# Altium schematic sheet ChargeControlBoard.SchDoc
size A3
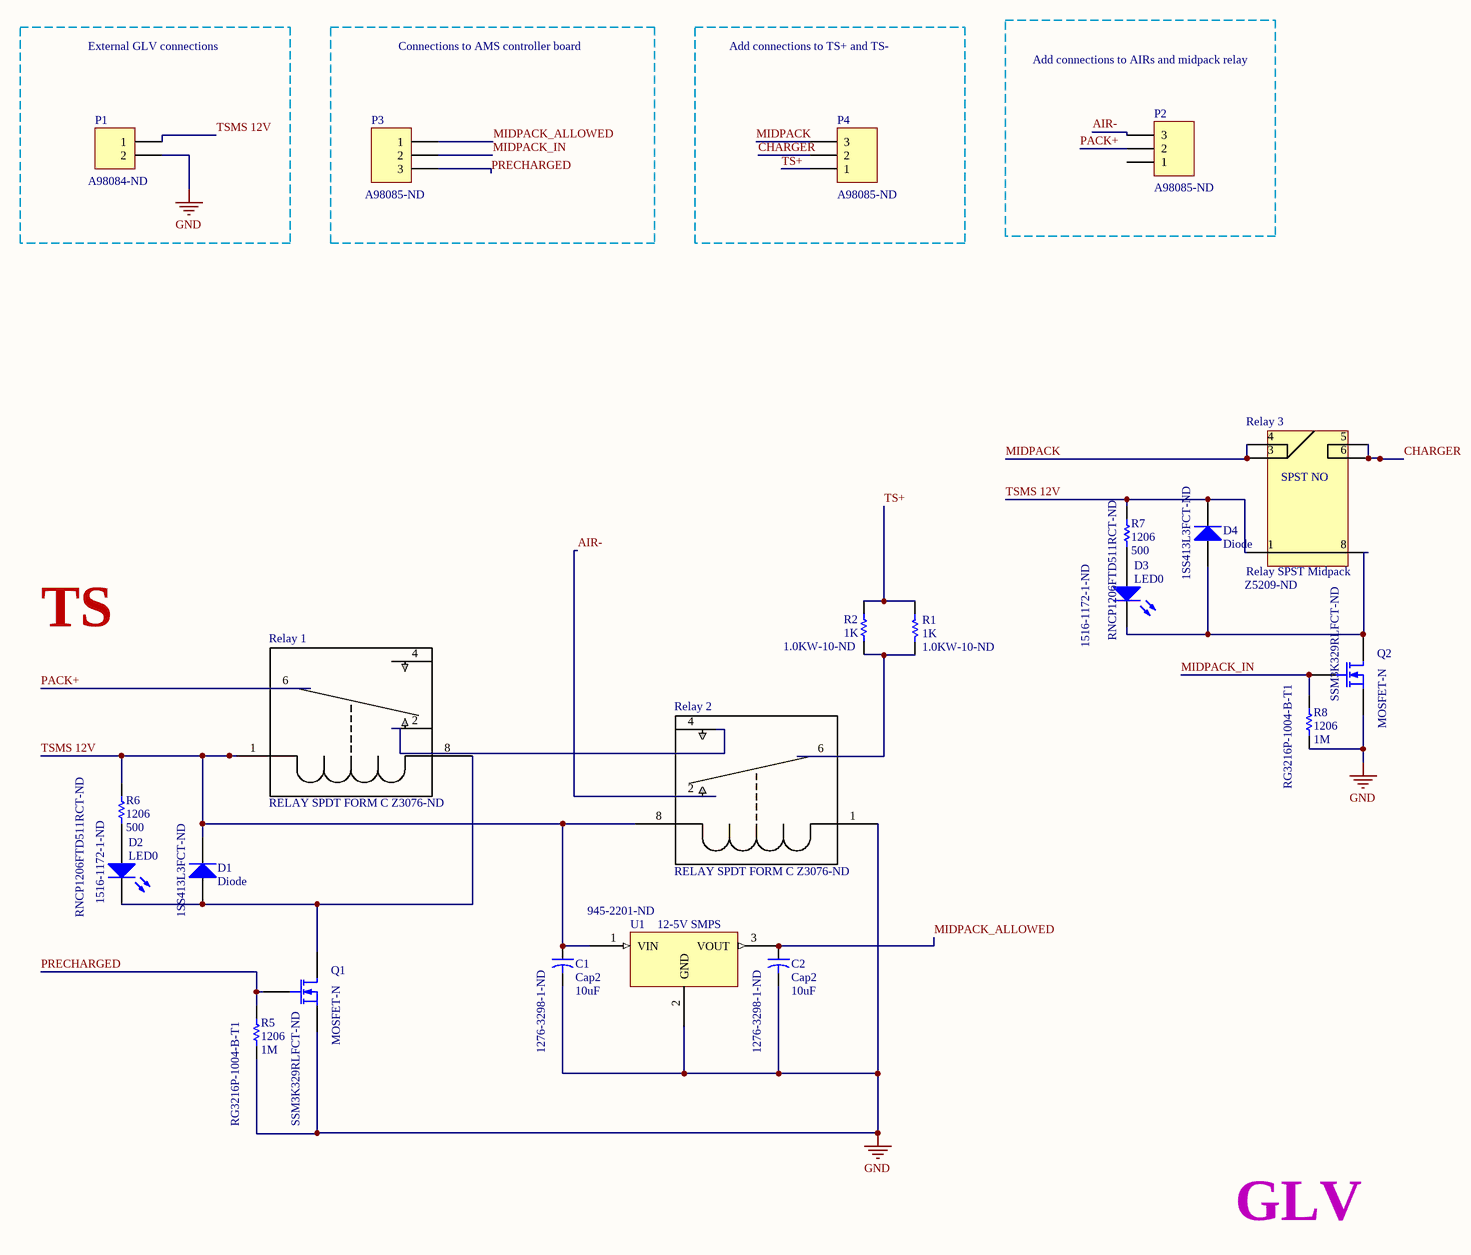
[diagram p0: ChargeControlBoard.SchDoc]

## Parts
C1  Cap2  value 10uF  Supplier Part Number 1: 1276-3298-1-ND  [1206]
C2  Cap2  value 10uF  Supplier Part Number 1: 1276-3298-1-ND  [1206]
D1  Diode  Supplier Part Number 1: 1SS413L3FCT-ND  [DIODE SODFL100X48-2N]
D2  LED0  Supplier Part Number 1: 1516-1172-1-ND  [C1206]
D3  LED0  Supplier Part Number 1: 1516-1172-1-ND  [C1206]
D4  Diode  Supplier Part Number 1: 1SS413L3FCT-ND  [DIODE SODFL100X48-2N]
P1  Supplier Part Number: A98084-ND  [2 Pos wire to board]  (hidden comment: Header 2)
P2  Supplier Part Number: A98085-ND  [3 Pos wire to board]  (hidden comment: Header 3)
P3  Supplier Part Number: A98085-ND  [3 Pos wire to board]  (hidden comment: Header 3)
P4  Supplier Part Number: A98085-ND  [3 Pos wire to board]  (hidden comment: Header 3)
Q1  MOSFET-N  Supplier Part Number 1: SSM3K329RLFCT-ND  [SOT23]
Q2  MOSFET-N  Supplier Part Number 1: SSM3K329RLFCT-ND  [SOT23]
R1  value 1K  Supplier Part Number: 1.0KW-10-ND  [Res 1k 10W]  (hidden comment: Res1)
R2  value 1K  Supplier Part Number: 1.0KW-10-ND  [Res 1k 10W]  (hidden comment: Res1)
R5  1206  value 1M  Supplier Part Number 1: RG3216P-1004-B-T1  [1206 (High Density)]
R6  1206  value 500  Supplier Part Number 1: RNCP1206FTD511RCT-ND  [C1206]
R7  1206  value 500  Supplier Part Number 1: RNCP1206FTD511RCT-ND  [C1206]
R8  1206  value 1M  Supplier Part Number 1: RG3216P-1004-B-T1  [1206 (High Density)]
Relay_1  RELAY SPDT FORM C Z3076-ND  [RELAY SPDT FORM C Z3076-ND]
Relay_2  RELAY SPDT FORM C Z3076-ND  [RELAY SPDT FORM C Z3076-ND]  (net tie, no BOM)
Relay_3  Relay SPST Midpack  Supplier Part Number 1: Z5209-ND  [Relay SPDT NO MIDPACK]
U1  12-5V SMPS  Supplier Part Number 1: 945-2201-ND  [Rr-788E5]

## Blocks framed on the sheet
External GLV connections: P1
Connections to AMS controller board: P3
Add connections to TS+ and TS-: P4
Add connections to AIRs and midpack relay: P2

## Nets
GND: C1.2 C2.2 P1.2 Q1.3(S) Q2.3(S) R5.1 R8.1 Relay_2.1 U1.2(GND)
AIR-: P2.3 Relay_2.2
CHARGER: P4.2 Relay_3.5 Relay_3.6
MIDPACK: P4.3 Relay_3.3 Relay_3.4
MIDPACK_ALLOWED: C2.1 P3.1 U1.3(VOUT)
MIDPACK_IN: P3.2 Q2.2(G) R8.2
PACK+: P2.2 Relay_1.6
PRECHARGED: P3.3 Q1.2(G) R5.2
TS+: P4.1 R1.2 R2.2
TSMS 12V: C1.1 D1.2(K) D4.2(K) P1.1 R6.1 R7.1 Relay_1.1 Relay_2.8 Relay_3.1 U1.1(VIN)
NetD1_1: D1.1(A) D2.2(K) Q1.1(D) Relay_1.8
NetD2_1: D2.1(A) R6.2
NetD3_1: D3.1(A) R7.2
NetD3_2: D3.2(K) D4.1(A) Q2.1(D) Relay_3.8
NetR1_1: R1.1 R2.1 Relay_2.6
NetRelay_1_2: Relay_1.2 Relay_2.4

Not connected (* = marked no-connect by the designer): P2 1; Relay_1 4(3)

## Notes on the sheet
- TS
- GLV
- Document name:
- Date:
- Time:
- Project name:
- Drawn by:
- Validation
- Sheet
- University of Victoria
- 3800 Finnerty Road
- Victoria BC V8P 5C2
- of
- Revision:
- CANADA
- Size:
- A3
- (in symbol Relay SPST Midpack) SPST NO

## Library data of the parts
C1 C2 = Cap2: Capacitor; Published: 23-Sep-2002; PackageReference: CAPR5-4X5; Publisher: Altium Limited; PackageDescription: Capacitor; 2 Leads; Supplier 1: Digi-Key
D1 D4 = Diode: Switching diode; Published: 8-Jun-2000; LatestRevisionDate: 17-Jul-2002; LatestRevisionNote: Re-released for DXP Platform.; PackageVersion: Sep-1996; PackageReference: SMC; Publisher: Altium Limited; PackageDescription: DO-214-AB/SMC; 2 C-Bend Leads; Body 7.9 x 5.9 mm, inc. leads (LxW); Code_JEDEC: DO-214-AB; Supplier 1: Digi-Key
D2 D3 = LED0: Typical INFRARED GaAs LED; Published: 8-Jun-2000; LatestRevisionDate: 08-Jul-2005; LatestRevisionNote: Mech Layer 1 removed.; PackageReference: LED-0; Publisher: Altium Limited; PackageDescription: LED; 2 Leads; Supplier 1: Digi-Key
P1 = Header 2: Header, 2-Pin; LatestRevisionDate: 17-Jul-2002; LatestRevisionNote: Re-released for DXP Platform.; Publisher: Altium Limited
P2-P4 = Header 3: Header, 3-Pin; LatestRevisionDate: 17-Jul-2002; LatestRevisionNote: Re-released for DXP Platform.; Publisher: Altium Limited
Q1 Q2 = MOSFET-N: N-Channel MOSFET; Published: 8-Jun-2000; LatestRevisionDate: 17-Jul-2002; LatestRevisionNote: Re-released for DXP Platform.; PackageVersion: 1995/1996; PackageReference: E3; Publisher: Altium Limited; PackageDescription: TO, Flat Index; 3 In-Line, Axial Leads; Body Dia. 4.6mm; Lead Dia. 0.5 mm (max); Supplier 1: Digi-Key
R1 R2 R5-R8 = Res1: Resistor; Published: 8-Jun-2000; LatestRevisionDate: 17-Jul-2002; LatestRevisionNote: Re-released for DXP Platform.; PackageReference: AXIAL-0.3; Publisher: Altium Limited; PackageDescription: Axial Device, Thru-Hole; 2 Leads; 0.3 in Pin Spacing
  R5-R8: Supplier 1: Digi-Key
U1 = Component_1: Supplier 1: Digi-Key
Relay_1 Relay_2 = RELAY SPDT FORM C Z3076-ND: Supplier Part Number 1: Z3076-ND